# EAGLE design MidiAdapter (EAGLE 5.11)
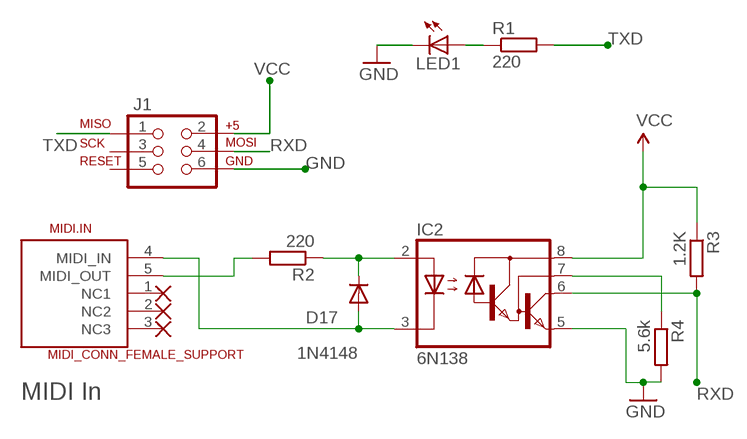
[diagram p0: schematic, sheet 1]

## Parts
D17  1N4148  DIODE1N4148  [DIODE-1N4148]
IC2  6N138  [DIL08]
J1  AVR_SPI_PRG_6OFFSET_PADS  [2X3_OFFSET]
LED1  LED1206  [LED-1206]
MIDI.IN  MIDI_CONN_FEMALE_SUPPORT  [DIN_5_FEMALE_SUPPORT]
R1  220  R-EU_R1206  [R1206]
R2  220  R-EU_R1206  [R1206]
R3  1.2K  R-EU_R1206  [R1206]
R4  5.6k  R-EU_R1206  [R1206]

## Nets
GND: IC2.5(GND) J1.6 LED1.C R4.2
MIDI_IN: D17.A IC2.3(C) MIDI.IN.4(MIDI_IN)
MIDI_OUT: MIDI.IN.5(MIDI_OUT) R2.2
MIDI_OUT2: D17.C IC2.2(A) R2.1
N$2: LED1.A R1.1
N$96: IC2.7(VB) R4.1
RXD: IC2.6(VO) J1.4 R3.2
TXD: J1.1 R1.2
VCC: IC2.8(VCC) J1.2 R3.1
Unconnected: J1.3 J1.5 MIDI.IN.1(NC1) MIDI.IN.2(NC2) MIDI.IN.3(NC3)

## Notes on the sheet
- MIDI In

## Library data of the parts
D17 = meeblip:DIODE: Diodes 1N4148 and 1N4001 power diodes.
IC2 = meeblip:6N138: MOTOROLA OPTO COUPLER
J1 = SparkFun:AVR_SPI_PRG_6: AVR ISP 6 Pin This is the reduced ISP connector for AVR programming. Common on Arduino. This footprint will take up less PCB space and can be used with a 10-pin to 6-pin adapter such as SKU: BOB-08508
LED1 = SparkFun:LED: LEDs Standard schematic elements and footprints for 5mm, 3mm, 1206, and 0603 sized LEDs. 5mm - Spark Fun Electronics SKU : COM-00529 (and others)
MIDI.IN = Reflex:MIDI_CONN_FEMALE_SUPPORT
R1-R4 = meeblip:R-EU_: RESISTOR, European symbol

## Net classes
0 default: width 0.508 mm

## Board
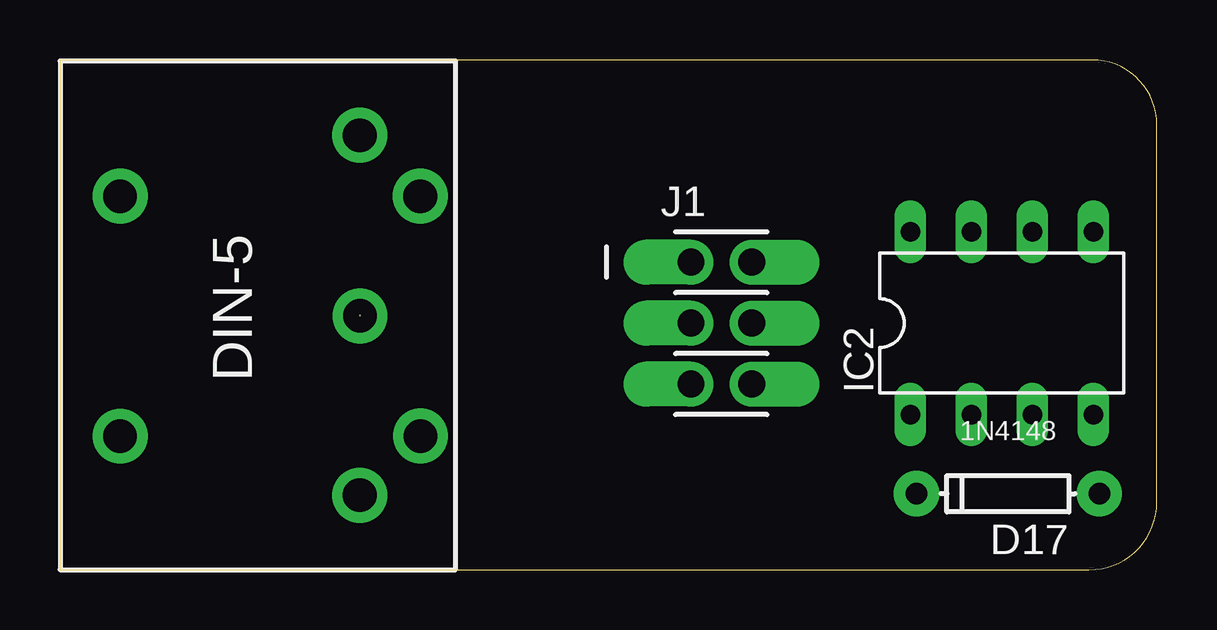
[diagram p1: board, top side]
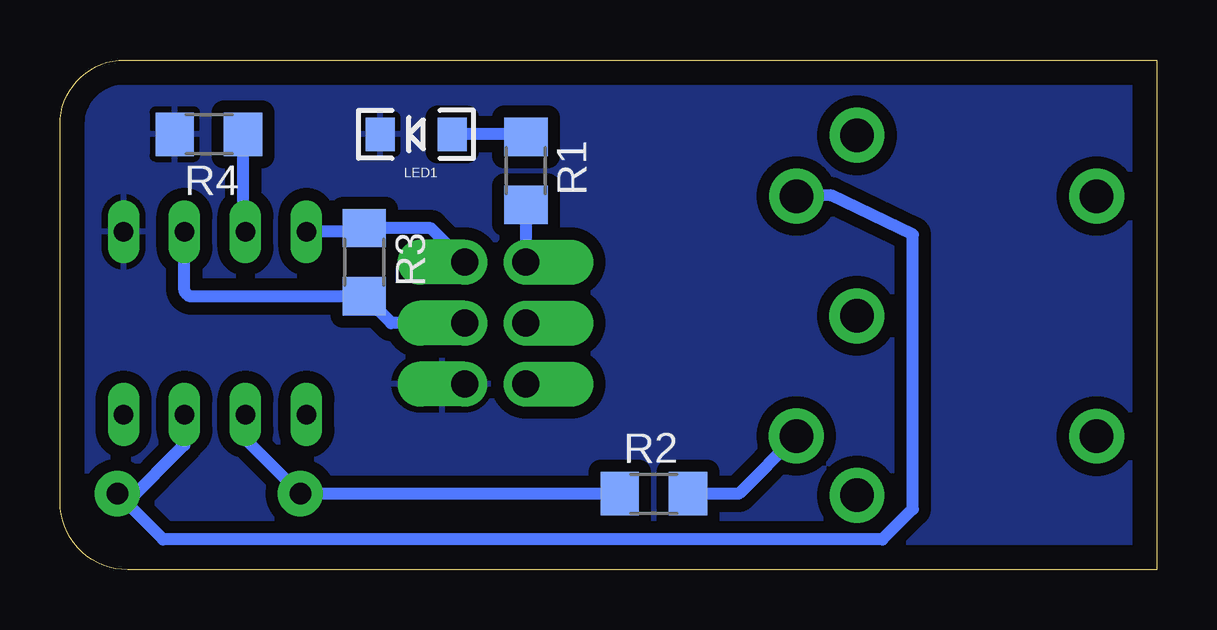
[diagram p2: board, bottom side, seen from below]

Size 45.7 x 21.26 mm. Coordinates in mm from the lower left corner, seen from the top.
Outline: 0,0 42.87,0 arc90 45.7,2.83 45.7,18.57 arc90 43.01,21.26 0,21.26 0,0
Copper layers (1*16): Top 0.035mm / dielectric 1.5mm / Bottom 0.035mm
Design rules "default": minimum track width 10mil, minimum drill 24mil, track to track 8mil, track to pad 8mil, pad to pad 8mil, via to via 8mil, smd to smd 8mil, copper to edge 40mil, drill to drill 8mil, minimum pad ring 10mil, minimum via ring 8mil, stop-mask expansion 4mil, vias tented up to drill 0mil, thermal gap 10mil
Milling: 6 lines

### Footprints (pad centres in the part's own frame; a part is rotated, then mirrored left to right if it is on the bottom)
DIODE-1N4148 = drill 0.9 pad 1.88 round: A -3.81,0; C 3.81,0
DIL08 = drill 0.813 long: 1 -3.81,-3.81; 2 -1.27,-3.81; 3 1.27,-3.81; 4 3.81,-3.81; 5 3.81,3.81; 6 1.27,3.81; 7 -1.27,3.81; 8 -3.81,3.81
2X3_OFFSET = drill 1.118 pad 1.88 offset: 1 -2.54,-1.27; 2 -2.54,1.27; 3 0,-1.27; 4 0,1.27; 5 2.54,-1.27; 6 2.54,1.27
LED-1206 = smd 1.2 x 1.4: A -1.5,0; C 1.5,0
DIN_5_FEMALE_SUPPORT = drill 1.4 pad 2.286 round: 1 0.46,3.61; 2 -7.07,3.6; 3 7.94,3.6; 4 -4.53,6.12; 5 5.47,6.13; 6 -4.53,-6.382; 7 5.478,-6.382
R1206 = smd 1.6 x 1.803: 1 -1.422,0; 2 1.422,0

### Placement (x,y rotation side)
D17  39.5,3.17 180 top
IC2  39.24,10.29 0 top
J1  27.56,10.29 270 top
LED1  30.86,18.16 180 bottom
MIDI.IN  8.89,11.05 270 top
R1  26.29,16.64 270 bottom
R2  20.95,3.17 0 bottom
R3  33.02,12.83 270 bottom
R4  39.5,18.16 180 bottom

### Tracks (layer width: path | path; a pad name or v marks a point on that pad's centre or on a via)
GND
  pour Bottom (isolate 0.508): 45.72,21.21 0,21.21 0,0 45.72,0
MIDI_IN
  Bottom 0.508: MIDI.IN.4 13.59,15.62 10.16,13.97 10.16,2.54 11.43,1.27 41.4,1.27 42.93,2.79 | 42.93,2.79 D17.A | IC2.3 40.51,5.21 42.93,2.79
MIDI_OUT
  Bottom 0.508: MIDI.IN.5 17.42,3.17 R2.2
MIDI_OUT2
  Bottom 0.508: IC2.2 37.97,5.46 D17.C R2.1
N$2
  Bottom 0.508: R1.1 26.39,18.16 LED1.A
N$96
  Bottom 0.508: R4.1 38.08,14.2 IC2.7
RXD
  Bottom 0.508: J1.4 31.9,10.29 R3.2 40.13,11.41 arc90 40.51,11.66 IC2.6
TXD
  Bottom 0.508: R1.2 J1.1
VCC
  Bottom 0.508: J1.2 30.25,14.25 R3.1 33.02,14.1 IC2.8

### Text on the board
_tsilk: min | MOUT